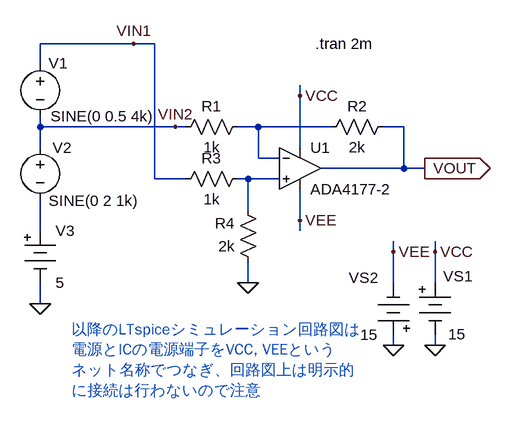
[diagram p0: schematic fig-01-02-18.asc]
fig-01-02-18.asc, the LTspice schematic file:
Version 4
SHEET 1 880 680
WIRE -48 -16 -192 -16
WIRE -16 -16 -48 -16
WIRE -192 16 -192 -16
WIRE 208 64 208 48
WIRE -192 112 -192 96
WIRE 16 112 -192 112
WIRE 32 112 16 112
WIRE 144 112 112 112
WIRE 256 112 144 112
WIRE 368 112 336 112
WIRE -192 144 -192 112
WIRE 208 144 208 64
WIRE 144 160 144 112
WIRE 176 160 144 160
WIRE 368 176 368 112
WIRE 368 176 240 176
WIRE 400 176 368 176
WIRE -16 192 -16 -16
WIRE 32 192 -16 192
WIRE 128 192 112 192
WIRE 176 192 128 192
WIRE 128 240 128 192
WIRE 208 256 208 208
WIRE -192 272 -192 224
WIRE 208 272 208 256
WIRE 352 304 352 288
WIRE 416 304 416 288
WIRE 128 352 128 320
WIRE 352 352 352 304
WIRE 416 352 416 304
WIRE -192 384 -192 352
WIRE 352 448 352 432
WIRE 416 448 416 432
FLAG 128 352 0
FLAG 400 176 VOUT
IOPIN 400 176 Out
FLAG -48 -16 VIN1
FLAG -192 384 0
FLAG 16 112 VIN2
FLAG 352 448 0
FLAG 416 448 0
FLAG 352 304 VEE
FLAG 416 304 VCC
FLAG 208 64 VCC
FLAG 208 256 VEE
SYMBOL res 128 96 R90
WINDOW 0 0 56 VBottom 2
WINDOW 3 32 56 VTop 2
SYMATTR InstName R1
SYMATTR Value 1k
SYMBOL res 352 96 R90
WINDOW 0 0 56 VBottom 2
WINDOW 3 32 56 VTop 2
SYMATTR InstName R2
SYMATTR Value 2k
SYMBOL voltage -192 0 R0
WINDOW 0 13 14 Left 2
WINDOW 3 16 96 Left 2
WINDOW 123 0 0 Left 0
WINDOW 39 0 0 Left 0
SYMATTR InstName V1
SYMATTR Value SINE(0 0.5 4k)
SYMBOL res 128 176 R90
WINDOW 0 0 56 VBottom 2
WINDOW 3 32 56 VTop 2
SYMATTR InstName R3
SYMATTR Value 1k
SYMBOL res 144 336 R180
WINDOW 0 36 76 Left 2
WINDOW 3 36 40 Left 2
SYMATTR InstName R4
SYMATTR Value 2k
SYMBOL voltage -192 128 R0
WINDOW 0 19 16 Left 2
WINDOW 3 13 98 Left 2
WINDOW 123 0 0 Left 0
WINDOW 39 0 0 Left 0
SYMATTR InstName V2
SYMATTR Value SINE(0 2 1k)
SYMBOL Misc\\battery -192 256 R0
WINDOW 123 0 0 Left 0
WINDOW 39 0 0 Left 0
SYMATTR InstName V3
SYMATTR Value 5
SYMBOL Misc\\battery 416 336 R0
WINDOW 0 13 6 Left 2
WINDOW 3 20 95 Left 2
SYMATTR InstName VS1
SYMATTR Value 15
SYMBOL Misc\\battery 352 448 R180
WINDOW 0 24 104 Left 2
WINDOW 3 24 16 Left 2
SYMATTR InstName VS2
SYMATTR Value 15
SYMBOL Opamps\\ADA4177-2 208 176 R0
SYMATTR InstName U1
TEXT 232 -16 Left 2 !.tran 2m
TEXT -144 424 Left 2 ;以降のLTspiceシミュレーション回路図は\n電源とICの電源端子をVCC, VEEという\nネット名称でつなぎ、回路図上は明示的\nに接続は行わないので注意

The netlist it stands for:
* fig-01-02-18.asc
R1 N001 VIN2 1k
R2 VOUT N001 2k
V1 VIN1 VIN2 SINE(0 0.5 4k)
R3 N002 VIN1 1k
R4 0 N002 2k
V2 VIN2 N003 SINE(0 2 1k)
V3 N003 0 5
VS1 VCC 0 15
VS2 0 VEE 15
* U1: ADA4177-2 (symbol Opamps\ADA4177-2 not available, pins judged from their places): In+=N002 In-=N001 V+=VCC V-=VEE OUT=VOUT
.tran 2m
* 以降のLTspiceシミュレーション回路図は
* 電源とICの電源端子をVCC, VEEという
* ネット名称でつなぎ、回路図上は明示的
* に接続は行わないので注意
.backanno
.end